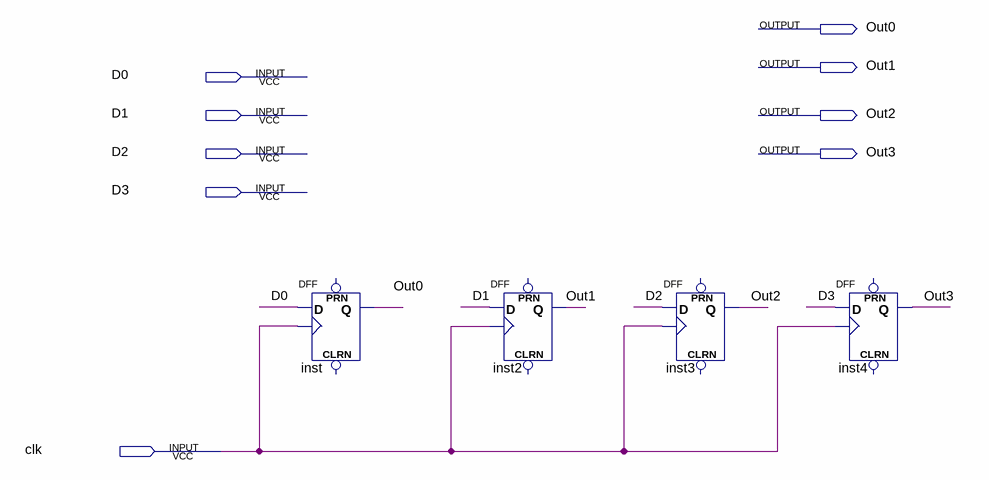
[diagram p0: schematic sheet]
// Quartus schematic Reg_4.bdf as structural Verilog: 4 symbols, 9 pins
module Reg_4 (
  input  D0,
  input  D1,
  input  D2,
  input  D3,
  input  clk,
  output Out0,
  output Out1,
  output Out2,
  output Out3
);

  DFF inst (.CLK(clk), .D(D0), .Q(Out0));  // open: CLRN, PRN
  DFF inst2 (.CLK(clk), .D(D1), .Q(Out1));  // open: CLRN, PRN
  DFF inst3 (.CLK(clk), .D(D2), .Q(Out2));  // open: CLRN, PRN
  DFF inst4 (.CLK(clk), .D(D3), .Q(Out3));  // open: CLRN, PRN
endmodule
